# Altium schematic sheet SuperFin Baseboard pg2.SchDoc
size B
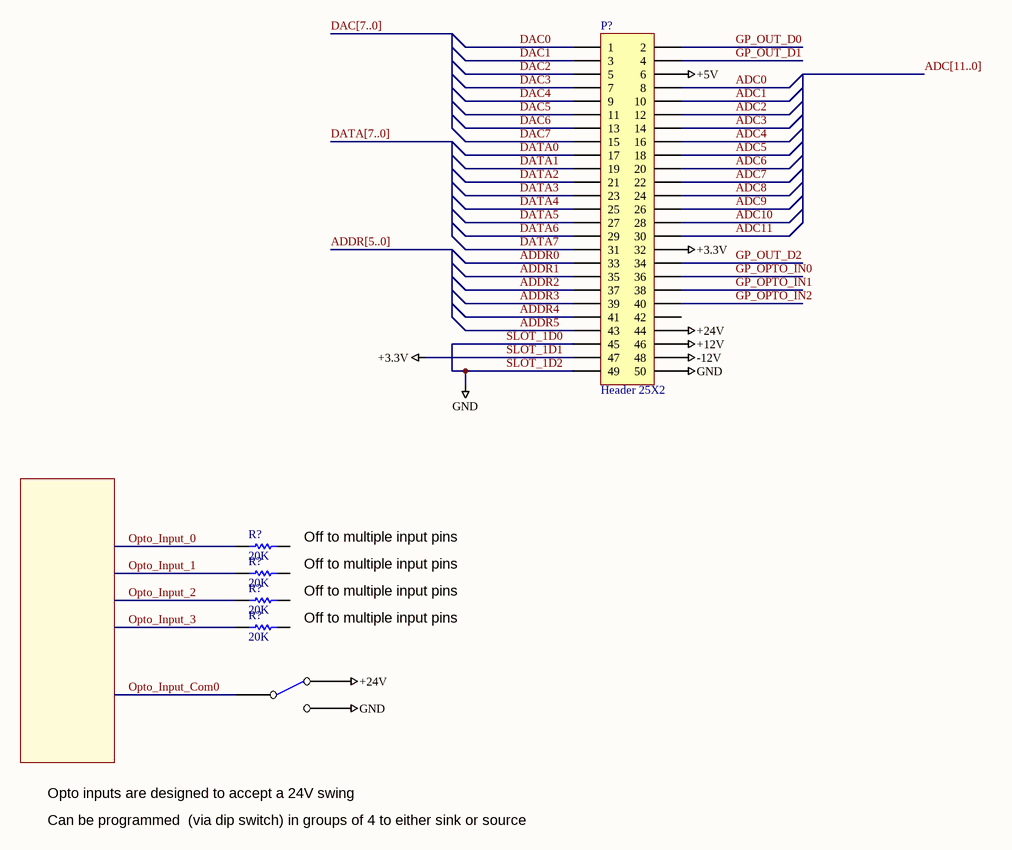
[diagram p0: SuperFin Baseboard pg2.SchDoc]

## Parts
(Parts that share a designator on the sheet are numbered #1, #2 ... from top to bottom, then left to right.)
*?  SW_SPDT_DOUG  (value not drawn)
P?  Header 25X2  [HDR2X25]
R?#1  value 20K  [SMD_0805]  (hidden comment: Res 0805)
R?#2  value 20K  [SMD_0805]  (hidden comment: Res 0805)
R?#3  value 20K  [SMD_0805]  (hidden comment: Res 0805)
R?#4  value 20K  [SMD_0805]  (hidden comment: Res 0805)

## Nets
+5V: P?.6
+12V: P?.46
+24V: *?.NC P?.44
-12V: P?.48
SLOT_1D0: *?.NO P?.45 P?.49 P?.50  [also labelled GND, SLOT_1D2]
SLOT_1D1: P?.32 P?.47  [also labelled +3.3V]
ADC0: P?.8
ADC1: P?.10
ADC2: P?.12
ADC3: P?.14
ADC4: P?.16
ADC5: P?.18
ADC6: P?.20
ADC7: P?.22
ADC8: P?.24
ADC9: P?.26
ADC10: P?.28
ADC11: P?.30
ADDR0: P?.33
ADDR1: P?.35
ADDR2: P?.37
ADDR3: P?.39
ADDR4: P?.41
ADDR5: P?.43
DAC0: P?.1
DAC1: P?.3
DAC2: P?.5
DAC3: P?.7
DAC4: P?.9
DAC5: P?.11
DAC6: P?.13
DAC7: P?.15
DATA0: P?.17
DATA1: P?.19
DATA2: P?.21
DATA3: P?.23
DATA4: P?.25
DATA5: P?.27
DATA6: P?.29
DATA7: P?.31
GP_OPTO_IN0: P?.36
GP_OPTO_IN1: P?.38
GP_OPTO_IN2: P?.40
GP_OUT_D0: P?.2
GP_OUT_D1: P?.4
GP_OUT_D2: P?.34
Opto_Input_0: R?#1.1
Opto_Input_1: R?#2.1
Opto_Input_2: R?#3.1
Opto_Input_3: R?#4.1
Opto_Input_Com0: *?.COM

Not connected (* = marked no-connect by the designer): P? 42; R?#1 2; R?#2 2; R?#3 2; R?#4 2

## Buses and harness runs
bus ADC[11..0]
bus ADDR[5..0]
bus DAC[7..0]
bus DATA[7..0]

## Notes on the sheet
- (near R?#1) Off to multiple input pins
- (near R?#2) Off to multiple input pins
- (near R?#3) Off to multiple input pins
- (near R?#4) Off to multiple input pins
- Opto inputs are designed to accept a 24V swing
- Can be programmed  (via dip switch) in groups of 4 to either sink or source

## Library data of the parts
*? = SW_SPDT_DOUG: Right: 20; Bottom: 40
P? = Header 25X2: Header, 25-Pin, Dual row; LatestRevisionDate: 17-Jul-2002; LatestRevisionNote: Re-released for DXP Platform.; Publisher: Altium Limited
R?#1-R?#4 = Res SMD: Resistor 0805; Manufacturer: Vishay/Dale; Manuf p/n: CRCW080520KFKEA; Vendor: DIGIKEY; Vendor p/n: 541-20KCCT-ND; Vendor Mult.: 10; COST: 0.09